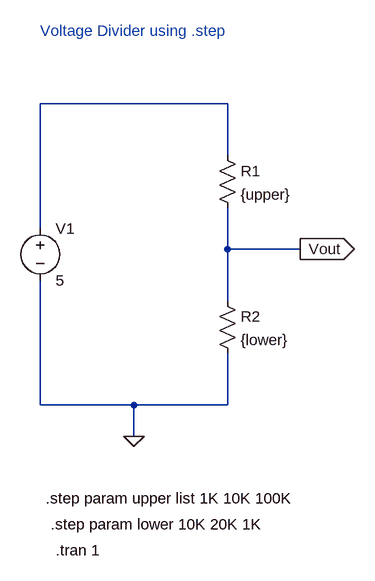
[diagram p0: schematic 2. Voltage Divider using step.asc]
2. Voltage Divider using step.asc, the LTspice schematic file:
Version 4
SHEET 1 880 680
WIRE 352 -48 64 -48
WIRE 352 32 352 -48
WIRE 64 144 64 -48
WIRE 352 176 352 112
WIRE 464 176 352 176
WIRE 352 256 352 176
WIRE 64 416 64 224
WIRE 208 416 64 416
WIRE 352 416 352 336
WIRE 352 416 208 416
WIRE 208 464 208 416
FLAG 464 176 Vout
IOPIN 464 176 Out
FLAG 208 464 0
SYMBOL voltage 64 128 R0
WINDOW 123 0 0 Left 0
WINDOW 39 0 0 Left 0
SYMATTR InstName V1
SYMATTR Value 5
SYMBOL res 336 16 R0
SYMATTR InstName R1
SYMATTR Value {upper}
SYMBOL res 336 240 R0
SYMATTR InstName R2
SYMATTR Value {lower}
TEXT 72 560 Left 2 !.step param upper list 1K 10K 100K
TEXT 80 600 Left 2 !.step param lower 10K 20K 1K
TEXT 64 -160 Left 2 ;Voltage Divider using .step
TEXT 88 640 Left 2 !.tran 1

The netlist it stands for:
* 2. Voltage Divider using step.asc
V1 N001 0 5
R1 N001 Vout {upper}
R2 Vout 0 {lower}
.step param upper list 1K 10K 100K
.step param lower 10K 20K 1K
* Voltage Divider using .step
.tran 1
.backanno
.end